# EAGLE schematic ChladniEagle (EAGLE 9.4.2)
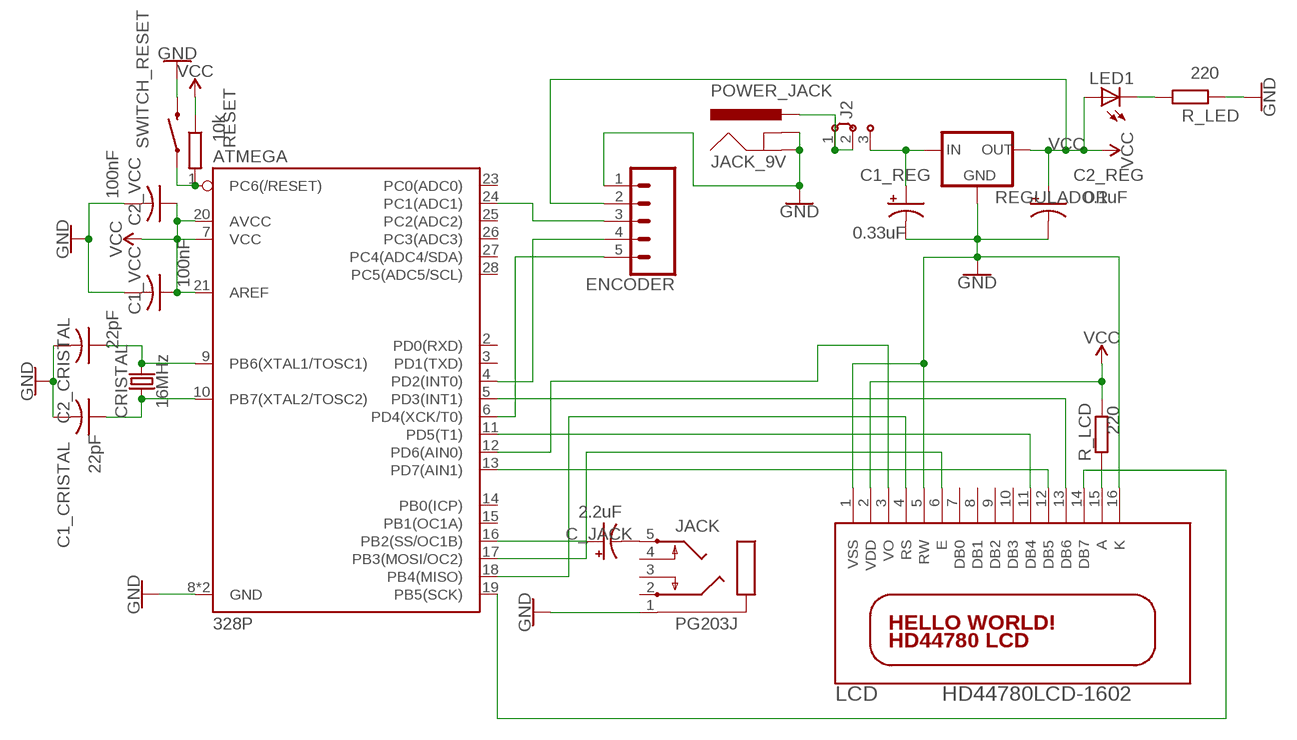
[diagram p0: schematic, sheet 1]

## Parts
ATMEGA  328P  ATMEGA328P_PDIP  [DIP28]
C1_CRISTAL  C-US025-024X044  [C025-024X044]
C1_REG  CPOL-USE2,5-6E  [E2,5-6E]
C1_VCC  C-US025-024X044  [C025-024X044]
C2_CRISTAL  C-US025-024X044  [C025-024X044]
C2_REG  CPOL-USE2,5-6E  [E2,5-6E]
C2_VCC  C-US025-024X044  [C025-024X044]
C_JACK  CPOL-USE2,5-6E  [E2,5-6E]
CRISTAL  16MHz  CRYSTAL-16MHZPTH-HC49US  [HC49US]
ENCODER  CONN_05NO_SILK  [1X05_NO_SILK]
J2  J2X2MM  [04C]
JACK  PG203J  [PG203J]
JACK_9V  POWER_JACK  [POWER_JACK_PTH]
LCD  HD44780LCD-1602  [LCD1602]
LED1  LED5MM  [LED5MM]
R_LCD  R-EU_0204/7  [0204/7]
R_LED  R-EU_0204/7  [0204/7]
REGULADOR  V_REG_78XX-TO-220  [TO-220-ALT]
RESET  R-EU_0204/7  [0204/7]
SWITCH_RESET  MOMENTARY-SWITCH-SPST-PTH-6.0MM  [TACTILE_SWITCH_PTH_6.0MM]

## Nets
GND: ATMEGA.8(GND) ATMEGA.22(GND) C1_CRISTAL.2 C1_VCC.2 C2_CRISTAL.2 C2_VCC.2 ENCODER.1 JACK.1 JACK_9V.GND JACK_9V.GNDBREAK R_LED.2 SWITCH_RESET.3
N$1: C1_REG.+ J2.3 REGULADOR.IN
N$2: ATMEGA.9(PB6(XTAL1/TOSC1)) C2_CRISTAL.1 CRISTAL.2
N$3: ATMEGA.10(PB7(XTAL2/TOSC2)) C1_CRISTAL.1 CRISTAL.1
N$4: LED1.K(C) R_LED.1
N$5: ATMEGA.1(PC6(/RESET)) RESET.2 SWITCH_RESET.1
N$6: J2.1 J2.2 JACK_9V.PWR
N$7: C_JACK.- JACK.5
N$8: LCD.15(A) R_LCD.1
N$9: ATMEGA.19(PB5(SCK)) LCD.14(DB7)
N$10: ATMEGA.5(PD3(INT1)) LCD.13(DB6)
N$11: ATMEGA.13(PD7(AIN1)) LCD.12(DB5)
N$12: ATMEGA.11(PD5(T1)) LCD.11(DB4)
N$13: ATMEGA.17(PB3(MOSI/OC2)) LCD.6(E)
N$14: ATMEGA.16(PB2(SS/OC1B)) C_JACK.+
N$15: ATMEGA.18(PB4(MISO)) LCD.4(RS)
N$16: ATMEGA.12(PD6(AIN0)) LCD.3(VO)
N$17: ATMEGA.6(PD4(XCK/T0)) ENCODER.5
N$18: ATMEGA.4(PD2(INT0)) ENCODER.4
N$20: ATMEGA.24(PC1(ADC1)) ENCODER.3
VCC: ATMEGA.7(VCC) ATMEGA.20(AVCC) ATMEGA.21(AREF) C1_VCC.1 C2_REG.+ C2_VCC.1 ENCODER.2 LCD.2(VDD) LED1.A R_LCD.2 REGULADOR.OUT RESET.1
VSS: C1_REG.- C2_REG.- LCD.1(VSS) LCD.5(RW) LCD.16(K) REGULADOR.GND ; supply symbol labelled GND
Unconnected: ATMEGA.2(PD0(RXD)) ATMEGA.3(PD1(TXD)) ATMEGA.14(PB0(ICP)) ATMEGA.15(PB1(OC1A)) ATMEGA.23(PC0(ADC0)) ATMEGA.25(PC2(ADC2)) ATMEGA.26(PC3(ADC3)) ATMEGA.27(PC4(ADC4/SDA)) ATMEGA.28(PC5(ADC5/SCL)) JACK.2 JACK.3 JACK.4 LCD.7(DB0) LCD.8(DB1) LCD.9(DB2) LCD.10(DB3)

## Library data of the parts
ATMEGA = SparkFun-IC-Microcontroller:ATMEGA328P_PDIP: Atmel 328P Through hole ATMEGA328P uC used in the Arduino 32kb flash, 1k EEPROM, 2k SRAM Datasheet <http://www.sparkfun.com/datasheets/Components/SMD/ATMega328.pdf> SparkFun Products Storefront component: AVR 28 Pin 20MHz 32K 6A/D - ATMega328P <https://www.sparkfun.com/products/9061> (COM-09061) SparkFun Simon Says - Through-Hole Soldering Kit <https://www.sparkfun.com/products/10547> (KIT-10547) SparkFun Learn to Solder - Simon Says <https://www.sparkfun.com/products/13708> (KIT-13708) SparkFun BigTime Watch Kit <https://www.sparkfun.com/products/11734> (KIT-11734) SparkFun ClockIt <https://www.sparkfun.com/products/10930> (KIT-10930) SparkFun Serial Enabled LCD Kit <https://www.sparkfun.com/products/10097> (LCD-10097) SparkFun Simon Tilts - Through Hole Soldering Kit <https://www.sparkfun.com/products/12634> (KIT-12634) SparkFun Frequency Counter Kit <https://www.sparkfun.com/products/10140> (KIT-10140) FabFM Radio Kit <https://www.sparkfun.com/products/11043> (KIT-11043) SparkFun Binary Blaster Kit <https://www.sparkfun.com/products/12037> (KIT-12037) SparkFun Metro-Gnome <https://www.sparkfun.com/products/9236> (KIT-09236) ATmega328 with Arduino Optiboot (Uno) <https://www.sparkfun.com/products/10524> (DEV-10524); PROD_ID: IC-09136
C1_CRISTAL C2_CRISTAL = adafruit:C-US: CAPACITOR, American symbol; CAPACITANCIA: 22pF
C1_REG = adafruit:CPOL-US: POLARIZED CAPACITOR, American symbol; CAPACITANCIA: 0.33uF
C1_VCC C2_VCC = adafruit:C-US: CAPACITOR, American symbol; CAPACITANCIA: 100nF
C2_REG = adafruit:CPOL-US: POLARIZED CAPACITOR, American symbol; CAPACITANCIA: 0.1uF
C_JACK = adafruit:CPOL-US: POLARIZED CAPACITOR, American symbol; CAPACITANCIA: 2.2uF
CRISTAL = SparkFun-Clocks:CRYSTAL-16MHZ: 16MHz Crystal Digikey Example <http://www.digikey.com/product-search/en?keywords=535-9122-1-ND> Frequency: 16MHz Frequency Stability: ±50ppm Frequency Tolerance: ±20ppm Load Capacitance: 18pF SparkFun Products: Pro Micro -5V/16MHz <https://www.sparkfun.com/products/12640> SparkFun Serial Enabled LCD Kit <https://www.sparkfun.com/products/10097>; PROD_ID: XTAL-08181; SF_ID: COM-00536
ENCODER = SparkFun-Connectors:CONN_05: Multi connection point. Often used as Generic Header-pin footprint for 0.1 inch spaced/style header connections On any of the 0.1 inch spaced packages, you can populate with these: Break Away Headers - Straight <https://www.sparkfun.com/products/116> (PRT-00116) Break Away Male Headers - Right Angle <https://www.sparkfun.com/products/553> (PRT-00553) Female Headers <https://www.sparkfun.com/products/115> (PRT-00115) Break Away Headers - Machine Pin <https://www.sparkfun.com/products/117> (PRT-00117) Break Away Female Headers - Swiss Machine Pin <https://www.sparkfun.com/products/743> (PRT-00743) For SCREWTERMINALS and SPRING TERMINALS visit here: Screw Terimnals on SparkFun.com <https://www.sparkfun.com/search/results?term=Screw+Terminals> (5mm/3.5mm/2.54mm spacing) This device is also useful as a general connection point to wire up your design to another part of your project. Our various solder wires solder well into these plated through hole pads. Hook-Up Wire - Assortment (Stranded, 22 AWG) <https://www.sparkfun.com/products/11375> (PRT-11375) Hook-Up Wire - Assortment (Solid Core, 22 AWG) <https://www.sparkfun.com/products/11367> (PRT-11367) View the entire wire category on our website here <https://www.sparkfun.com/categories/141> Special notes: Molex polarized connector foot print use with SKU : PRT-08231 with associated crimp pins and housings. 1MM SMD Version SKU: PRT-10208
J2 = jumper:J2: Jumper switch 2 x 2.5 mm
JACK = con-hirschmann:PG203J: MIC/HEADPHONE JACK KS-S stereo microphone/headphone jack PG203JN (Schukat); OC_FARNELL: unknown; OC_NEWARK: unknown
JACK_9V = SparkFun-Connectors:POWER_JACK: Power Jack Connector This is the standard 5.5mm barrel jack for power. The PTH is the most common, proven, reliable, footprint. The Slot footprint only works if the mill layer is transmitted to the PCB fab house so be warned. Here are the connectors we sell at SparkFun: DC Barrel Power Jack/Connector <https://www.sparkfun.com/products/119> (PRT-00119) DC Barrel Power Jack/Connector (SMD) <https://www.sparkfun.com/products/12748> (PRT-12748) DC Barrel Jack Adapter - Breadboard Compatible <https://www.sparkfun.com/products/10811> (PRT-10811) It is used on this SparkFun product (and many, many others): SparkFun RedBoard - Programmed with Arduino <https://www.sparkfun.com/products/12757> (DEV-12757) Also, if you need a mating power supply or connector, please check these out: Wall Adapter Power Supply - 9VDC 650mA <https://www.sparkfun.com/products/298> (TOL-00298) DC Barrel Jack Adapter - Male <https://www.sparkfun.com/products/10287> (PRT-10287); PROD_ID: CONN-08197
LCD = adafruit:HD44780LCD: HD44780 LCD Standard character type LCDs, available in sizes from 8x1 to 40x4!
LED1 = adafruit:LED: LED OSRAM: - CHIPLED LG R971, LG N971, LY N971, LG Q971, LY Q971, LO R971, LY R971 LH N974, LH R974 LS Q976, LO Q976, LY Q976 LO Q996 - Hyper CHIPLED LW Q18S LB Q993, LB Q99A, LB R99A - SideLED LS A670, LO A670, LY A670, LG A670, LP A670 LB A673, LV A673, LT A673, LW A673 LH A674 LY A675 LS A676, LA A676, LO A676, LY A676, LW A676 LS A679, LY A679, LG A679 - Hyper Micro SIDELED® LS Y876, LA Y876, LO Y876, LY Y876 LT Y87S - SmartLED LW L88C, LW L88S LB L89C, LB L89S, LG L890 LS L89K, LO L89K, LY L89K LS L896, LA L896, LO L896, LY L896 - TOPLED LS T670, LO T670, LY T670, LG T670, LP T670 LSG T670, LSP T670, LSY T670, LOP T670, LYG T670 LG T671, LOG T671, LSG T671 LB T673, LV T673, LT T673, LW T673 LH T674 LS T676, LA T676, LO T676, LY T676, LB T676, LH T676, LSB T676, LW T676 LB T67C, LV T67C, LT T67C, LS T67K, LO T67K, LY T67K, LW E67C LS E67B, LA E67B, LO E67B, LY E67B, LB E67C, LV E67C, LT E67C LW T67C LS T679, LY T679, LG T679 LS T770, LO T770, LY T770, LG T770, LP T770 LB T773, LV T773, LT T773, LW T773 LH T774 LS E675, LA E675, LY E675, LS T675 LS T776, LA T776, LO T776, LY T776, LB T776 LHGB T686 LT T68C, LB T68C - Hyper Mini TOPLED® LB M676 - Mini TOPLED Santana® LG M470 LS M47K, LO M47K, LY M47K Source: http://www.osram.convergy.de/
R_LCD R_LED = rcl:R-EU_: RESISTOR, European symbol; RESISTENCIA: 220; SPICEPREFIX: R
REGULADOR = SparkFun-IC-Power:V_REG_78XX: Voltage Regulator Standard 78xx regulator. IGO (Input Ground Output). Spark Fun Electronics SKU : COM-00107; PROD_ID: VREG-08450; SF_ID: COM-00107
RESET = rcl:R-EU_: RESISTOR, European symbol; RESISTENCIA: 10k; SPICEPREFIX: R
SWITCH_RESET = SparkFun-Switches:MOMENTARY-SWITCH-SPST: Momentary Switch (Pushbutton) - SPST Normally-open (NO) SPST momentary switches (buttons, pushbuttons). Variants PTH-12MM - 12mm square, through-hole Momentary Pushbutton Switch - 12mm Square <https://www.sparkfun.com/products/9190> (COM-09190) PTH-6.0MM, PTH-6.0MM-KIT - 6.0mm square, through-hole Mini Pushbutton Switch <https://www.sparkfun.com/products/97> (COM-00097) KIT package intended for soldering kit's - only one side of pads' copper is exposed. PTH-RIGHT-ANGLE-KIT - Right-angle, through-hole Right Angle Tactile Button <https://www.sparkfun.com/products/10791> - Used on SparkFun BigTime Watch Kit <https://www.sparkfun.com/products/11734> SMD-12MM - 12mm square, surface-mount Tactile Button - SMD (12mm) <https://www.sparkfun.com/products/12993> (COM-12993) Used on SparkFun PicoBoard <https://www.sparkfun.com/products/11888> SMD-4.5MM - 4.5mm Square Trackball Switch Used on SparkFun Blackberry Trackballer Breakout <https://www.sparkfun.com/products/13169> SMD-4.6MMX2.8MM - 4.60mm x 2.80mm, surface mount Used on SparkFun SAMD21 Mini Breakout <https://www.sparkfun.com/products/13664> SMD-5.2MM, SMD-5.2-REDUNDANT - 5.2mm square, surface-mount Mini Pushbutton Switch - SMD <https://www.sparkfun.com/products/8720> (COM-08720) Used on Arduino Pro Mini <https://www.sparkfun.com/products/11114> REDUNDANT package connects both switch circuits together SMD-6.0X3.5MM - 6.0 x 3.5mm, surface mount Momentary Reset Switch SMD <https://www.sparkfun.com/products/8229> (COM-08229) SMD-6.2MM-TALL - 6.2mm square, surface mount Tactile Button - SMD (6mm) <https://www.sparkfun.com/products/12992> Used on SparkFun Digital Sandbox <https://www.sparkfun.com/products/12651> SMD-RIGHT-ANGLE - Right-angle, surface mount Used on SparkFun Block for Intel® Edison - Arduino <https://www.sparkfun.com/products/13036>; PROD_ID: SWCH-08441; SF_SKU: COM-00097